# Altium schematic sheet LTC_6811-1.SchDoc
size 299 x 299 mm; DocumentNumber: 5; SheetNumber: 5; SheetTotal: 11
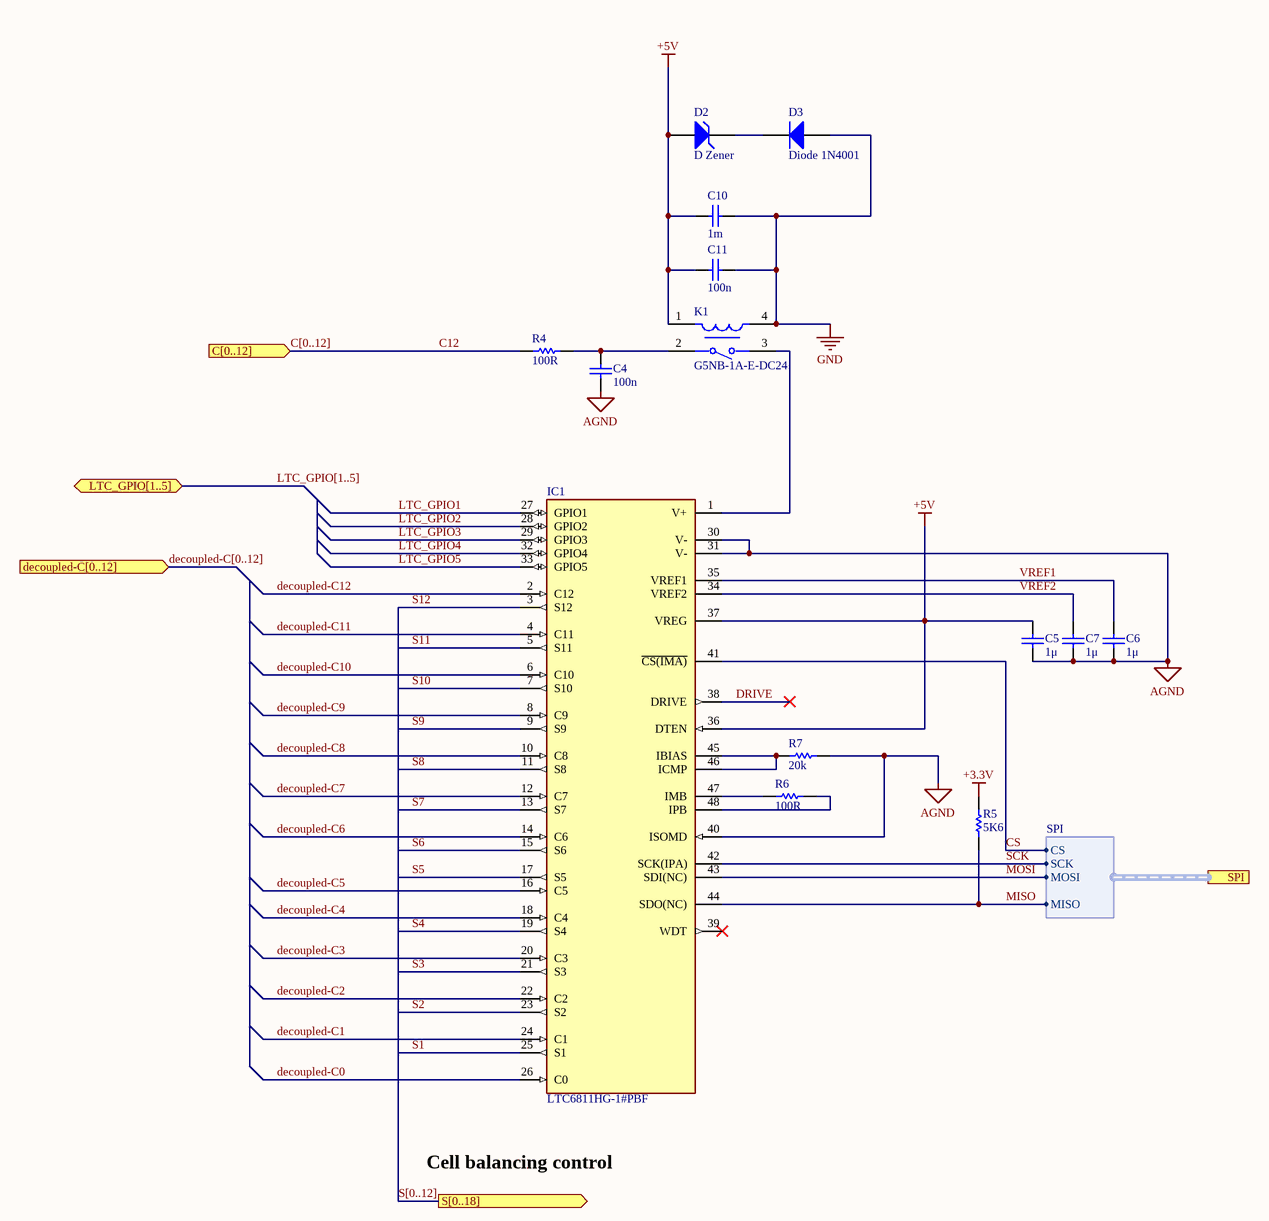
[diagram p0: LTC_6811-1.SchDoc]

## Parts
C4  100n  [CAPC0603(1608)55_N]
C5  1μ  [CAPC0603(1608)55_N]
C6  1μ  [CAPC0603(1608)55_N]
C7  1μ  [CAPC0603(1608)55_N]
C10  1m  [CAPC0603(1608)55_N]
C11  100n  [CAPC0603(1608)55_N]
D2  D Zener  [DIODE-0.7]
D3  Diode 1N4001  [DO-41]
IC1  LTC6811HG-1#PBF  [FP-G-48-05-08-1887-MFG]
K1  G5NB-1A-E-DC24  [FP-G5NB-1A-E-DC24-MFG]
R4  100R  [RESC0603(1608)_N]
R5  5K6  [RESC0603(1608)_N]
R6  100R  [RESC0603(1608)_N]
R7  20k  [RESC0603(1608)_N]

## Ports
C[0..12] (in), decoupled-C[0..12] (in), LTC_GPIO[1..5] (bidir), S[0..18] (out), SPI (harness SPI)

## Harnesses
SPI: SCK, MOSI, MISO, CS

## Nets
+3.3V: R5.2
+5V: C5.2 C10.1 C11.1 D2.1(A) IC1.36(DTEN) IC1.37(VREG) K1.1
AGND: C4.1 C5.1 C6.1 C7.1 IC1.30(V-) IC1.31(V-) IC1.40(ISOMD) R7.2
GND: C10.2 C11.2 D3.1(A) K1.4
C12: R4.1
CS: IC1.41(~{CS(IMA)}) ; port SPI.CS
decoupled-C0: IC1.26(C0)
decoupled-C1: IC1.24(C1)
decoupled-C2: IC1.22(C2)
decoupled-C3: IC1.20(C3)
decoupled-C4: IC1.18(C4)
decoupled-C5: IC1.16(C5)
decoupled-C6: IC1.14(C6)
decoupled-C7: IC1.12(C7)
decoupled-C8: IC1.10(C8)
decoupled-C9: IC1.8(C9)
decoupled-C10: IC1.6(C10)
decoupled-C11: IC1.4(C11)
decoupled-C12: IC1.2(C12)
DRIVE: IC1.38(DRIVE)
LTC_GPIO1: IC1.27(GPIO1)
LTC_GPIO2: IC1.28(GPIO2)
LTC_GPIO3: IC1.29(GPIO3)
LTC_GPIO4: IC1.32(GPIO4)
LTC_GPIO5: IC1.33(GPIO5)
MISO: IC1.44(SDO(NC)) R5.1 ; port SPI.MISO
MOSI: IC1.43(SDI(NC)) ; port SPI.MOSI
S1: IC1.25(S1)
S2: IC1.23(S2)
S3: IC1.21(S3)
S4: IC1.19(S4)
S5: IC1.17(S5)
S6: IC1.15(S6)
S7: IC1.13(S7)
S8: IC1.11(S8)
S9: IC1.9(S9)
S10: IC1.7(S10)
S11: IC1.5(S11)
S12: IC1.3(S12)
SCK: IC1.42(SCK(IPA)) ; port SPI.SCK
VREF1: C6.2 IC1.35(VREF1)
VREF2: C7.2 IC1.34(VREF2)
NetC4_2: C4.2 K1.2 R4.2
NetD2_2: D2.2(K) D3.2(K)
NetIC1_1: IC1.1(V+) K1.3
NetIC1_45: IC1.45(IBIAS) IC1.46(ICMP) R7.1
NetIC1_47: IC1.47(IMB) R6.1
NetIC1_48: IC1.48(IPB) R6.2

Not connected (* = marked no-connect by the designer): IC1 39(WDT)*

## Buses and harness runs
bus C[0..12] = port C[0..12]
bus decoupled-C[0..12] = port decoupled-C[0..12]
bus LTC_GPIO[1..5] = port LTC_GPIO[1..5]
bus S[0..12] = port S[0..18]

## Notes on the sheet
- Cell balancing control

## Library data of the parts
C4 C11 = Cap 100n: Keramikvielschichtkondensator, SMD, Baureihe MC, ± 10%; Manufacturer: TDK; Voltage Rating: 50V; OC_MOUSER: CGA3E2X7R1H104K080AA; Value: 100n; PackageReference: 0603; Tolerance: ± 10%
C5-C7 = Cap 1μ: Keramikvielschichtkondensator, SMD, Baureihe MC, ± 10%; Manufacturer: TDK; Voltage Rating: 50V; OC_MOUSER: CGA3E3X5R1H105K080AB; Value: 1μ; PackageReference: 0603; Tolerance: ± 10%
C10 = Cap - template 0603: Keramikvielschichtkondensator, SMD, Baureihe MC, ± 10%; Manufacturer: eintragen !!!; Value: eintragen !!!; Tolerance: ± eintragen !!!; OC_MOUSER: eintragen !!!; PackageReference: 0603; Voltage Rating: eintragen !!!
D2 = D Zener: Zener Diode; Published: 8-Jun-2000; LatestRevisionDate: 17-Jul-2002; LatestRevisionNote: Re-released for DXP Platform.; PackageReference: DIODE-0.7; Publisher: Altium Limited; PackageDescription: Diode, Thru-Hole; 2 Leads; 0.7 in Pin Spacing
D3 = Diode 1N4001: 1 Amp General Purpose Rectifier; Published: 8-Jun-2000; LatestRevisionDate: 17-Jul-2002; LatestRevisionNote: Re-released for DXP Platform.; DatasheetVersion: 1998; PackageVersion: Aug-1999; PackageReference: DO-41; Publisher: Altium Limited; PackageDescription: Diode, Axial; Body 5.2 x 2.7 mm (LxDia. max), Lead Dia. 0.86 mm (max); Code_JEDEC: DO-204-AL; ComponentLink1Description: Manufacturer Link; ComponentLink1URL: http://www.fairchildsemi.com/; ComponentLink2Description: Datasheet; ComponentLink2URL: http://www.fairchildsemi.com/ds/1N%2F1N4001.pdf
IC1 = CMP-09132-000004-1: IC MONITOR BATT STACK 48SSOP; Manufacturer: Analog Devices; Max Supply Voltage: 55V; Min Supply Voltage: 4.5V; Standoff Height: 0.05mm; Number Of Cells: 12; Max Junction Temp: +150°C; Lead Free: Yes; Octopart: https://octopart.com/ltc6811hg-1%23pbf-analog+devices-88968888; Automotive: No; ComponentLink2URL: https://www.analog.com/media/en/technical-documentation/data-sheets/68111fb.pdf; Temperature Range High: +125°C; RoHS: TRUE; Device Class L3: Battery Management; Height: 2mm; Device Class L1: Integrated Circuits (ICs); ComponentLink2Description: Datasheet; Digikey Description: IC MONITOR BATT STACK 48SSOP; Device Class L2: Power Management ICs; Mouser Description: Sc-Automotive Multicell Battery Stack Monitor With Addressable Isospi Interface; Temperature Range Low: -40°C; Category: IC; Temperature: -40°C to +125°C; Package: G-48-05-08-1887; Manufacturer Part Number: LTC6811HG-1#PBF
K1 = CMP-08822-000175-1: RELAY GEN PURPOSE SPST 5A 24V; Release Time: 10ms; Max Voltage Rating (AC): 250V; Coil Resistance: 2.88kR; Coil Power: 200mW; Coil Type: Non-Latching; Coil Current: 8.3mA; Max Voltage Rating (DC): 30V; Relay Type: General Purpose; Radiation Hardening: No; Operate Time: 10ms; Packaging: Bulk; Number of Pins: 4; Weight: 4g; Throw Configuration: SPST; Contact Current Rating: 5A; Mount: Through Hole; Coil Voltage (DC): 24V; Termination: PC Pin; Max Operating Temperature: 70°C; Min Operating Temperature: -40°C; Series: G5NB-E; Package Quantity: 100
R4 R6 = Res 100R: Chipwiderstand, SMD, Baureihe MC, 1%; Manufacturer: Multicomp; Power: 100mW; PackageReference: 0603; Value: 100R; OC_FARNELL: 2447227
R5 = Res 5K6: Chipwiderstand, SMD, Baureihe MC, 1%; Manufacturer: Multicomp; Power: 100mW; PackageReference: 0603; Value: 5K6; OC_FARNELL: 9332219
R7 = Res - template 0603: Chipwiderstand, SMD, Baureihe MC, 1%; Manufacturer: Multicomp; Power: 100mW; PackageReference: 0603; Value: 20k; OC_FARNELL: eintragen!!!!